# Altium schematic sheet AB Amplifier.SchDoc
size 431 x 279 mm; Organization: ORGANIZATION; Address1: ADDRESS 1; Address2: ADDRESS 2; Address3: ADDRESS 3; Address4: ADDRESS 4; Revision: -; SheetNumber: 6; SheetTotal: 6; ENG_APP_DATE: --/--/--; DSN_APP_DATE: --/--/--; CHK_APP_DATE: --/--/--
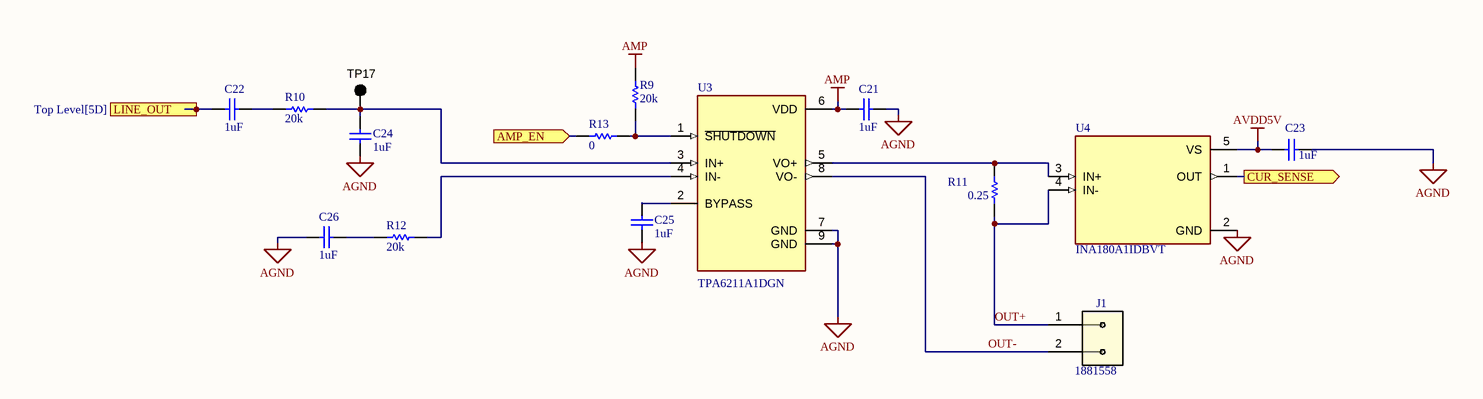
[diagram p0: AB Amplifier.SchDoc]

## Parts
C21  1uF  [0603]
C22  1uF  [0603]
C23  1uF  [0603]
C24  1uF  [0603]
C25  1uF  [0603]
C26  1uF  [0603]
J1  1881558  [1881558]
R9  20k  [0603]
R10  20k  [0603]
R11  0.25  [0805_HV]
R12  20k  [0603]
R13  0  [0603]
TP17  5001  [Testpoint pad]  (value not drawn)
U3  TPA6211A1DGN  [SOP65P490X110-9N]
U4  INA180A1IDBVT  [SOT95P280X145-5N]

## Ports
AMP_EN (in, see Top Level[5E], Power[5E]), CUR_SENSE (out, see Top Level[4D]), LINE_OUT (in, see Top Level[5D])

## Nets
AGND: C21.1 C23.1 C24.1 C25.1 C26.1 U3.7(GND) U3.9(GND) U4.2(GND)
AMP: C21.2 R9.2 U3.6(VDD)
AVDD5V: C23.2 U4.5(VS)
AMP_EN: R13.2 ; port AMP_EN
CUR_SENSE: U4.1(OUT) ; port CUR_SENSE
LINE_OUT: C22.1 ; port LINE_OUT
OUT+: J1.1 R11.1 U4.4(IN-)
OUT-: J1.2 U3.8(VO-)
NetC22_2: C22.2 R10.1
NetC24_2: C24.2 R10.2 TP17.1 U3.3(IN+)
NetC25_2: C25.2 U3.2(BYPASS)
NetC26_2: C26.2 R12.1
NetR9_1: R9.1 R13.1 U3.1(~{SHUTDOWN})
NetR11_2: R11.2 U3.5(VO+) U4.3(IN+)
NetR12_2: R12.2 U3.4(IN-)

## Notes on the sheet
- DWG. NO.
- REV.
- SHT.
- THIS DOCUMENT AND THE DATA DISCLOSED HEREIN OR HEREWITH IS THE PROPERTY OF ALTIUM LIMITED AND MAY BE FREELY DISTRIBUTED IN WHOLE. NO RIGHTS ARE RESERVED OR EXPRESS OR IMPLIED WARANTEE GIVEN.
- REVISION
- DESCRIPTION
- DATE
- APPROVED
- ENG:
- APPROVALS
- PROJECT
- DSN:
- CHK:
- REFERENCE DOCUMENTS
- PROJECT REVISION:
- TITLE
- DOCUMENT REVISION:
- DESIGN ITEM:
- BOM:
- FAB DWG:
- PCB DWG:
- ASSY DWG:
- SCALE:
- SIZE
- B
- CAGE CODE
- FILE NAME
- DWG NO.
- SHEET
- OF
- REV

## Library data of the parts
C21-C26 = C TBD 0603
R9 R10 R12 R13 = R TBD 0603
R11 = R TBD 0805
TP17 = 5001: TEST POINT PC MINI .040"D BLACK; Manufacturer: Keystone Electronics; Packaging: Bulk; Type: PC Test Point, Miniature; Terminal: 0.010" x 0.020" (0.25mm x 0.51mm) Phosphor Bronze Wire, Silver Plated; Mounting Type: 0.040" (1.02mm) Hole Diameter; Material: Base, Nylon 46, UL 94V-0; Color: Black; ComponentLink1URL: http://www.keyelco.com/product-pdf.cfm?p=1310; ComponentLink1Description: http://www.keyelco.com/product-pdf.cfm?p=1310; Supplier 1: Digi-Key; Supplier Part Number 1: 36-5001-ND; Manufacturer Part Number: 5001; RoHS: RoHS Compliant; Category: Test and Measurement; Stock: 443864; Pricing: 1=0.36, 10=0.327, 50=0.238, 100=0.2286, 250=0.20528, 500=0.19594, 1000=0.16328, 2500=0.14928, 5000=0.13995 (USD)
U3 = TPA6211A1DGN: 3.1-W, mono, analog input Class-AB audio amplifier; MF: Texas Instruments; SnapEDA_Link: https://www.snapeda.com/parts/TPA6211A1DGN/Texas+Instruments/view-part/?ref=snap; Package: HVSSOP-8 Texas Instruments; Value: *; MP: TPA6211A1DGN; Check_prices: https://www.snapeda.com/parts/TPA6211A1DGN/Texas+Instruments/view-part/?ref=eda
U4 = INA180A1IDBVT: 26V, 350kHz current sense amplifier; MF: Texas Instruments; MP: INA180A1IDBVT; Package: SOT-23-5 Texas Instruments; Purchase-URL: https://pricing.snapeda.com/search/part/INA180A1IDBVT/?ref=eda; Check_prices: https://www.snapeda.com/parts/INA180A1IDBVT/Texas+Instruments/view-part/?ref=eda; SnapEDA_Link: https://www.snapeda.com/parts/INA180A1IDBVT/Texas+Instruments/view-part/?ref=snap; Price: None; Availability: In Stock; Value: *